# EAGLE schematic MOSFET_Driver_8_24_2505D (EAGLE 6.1)
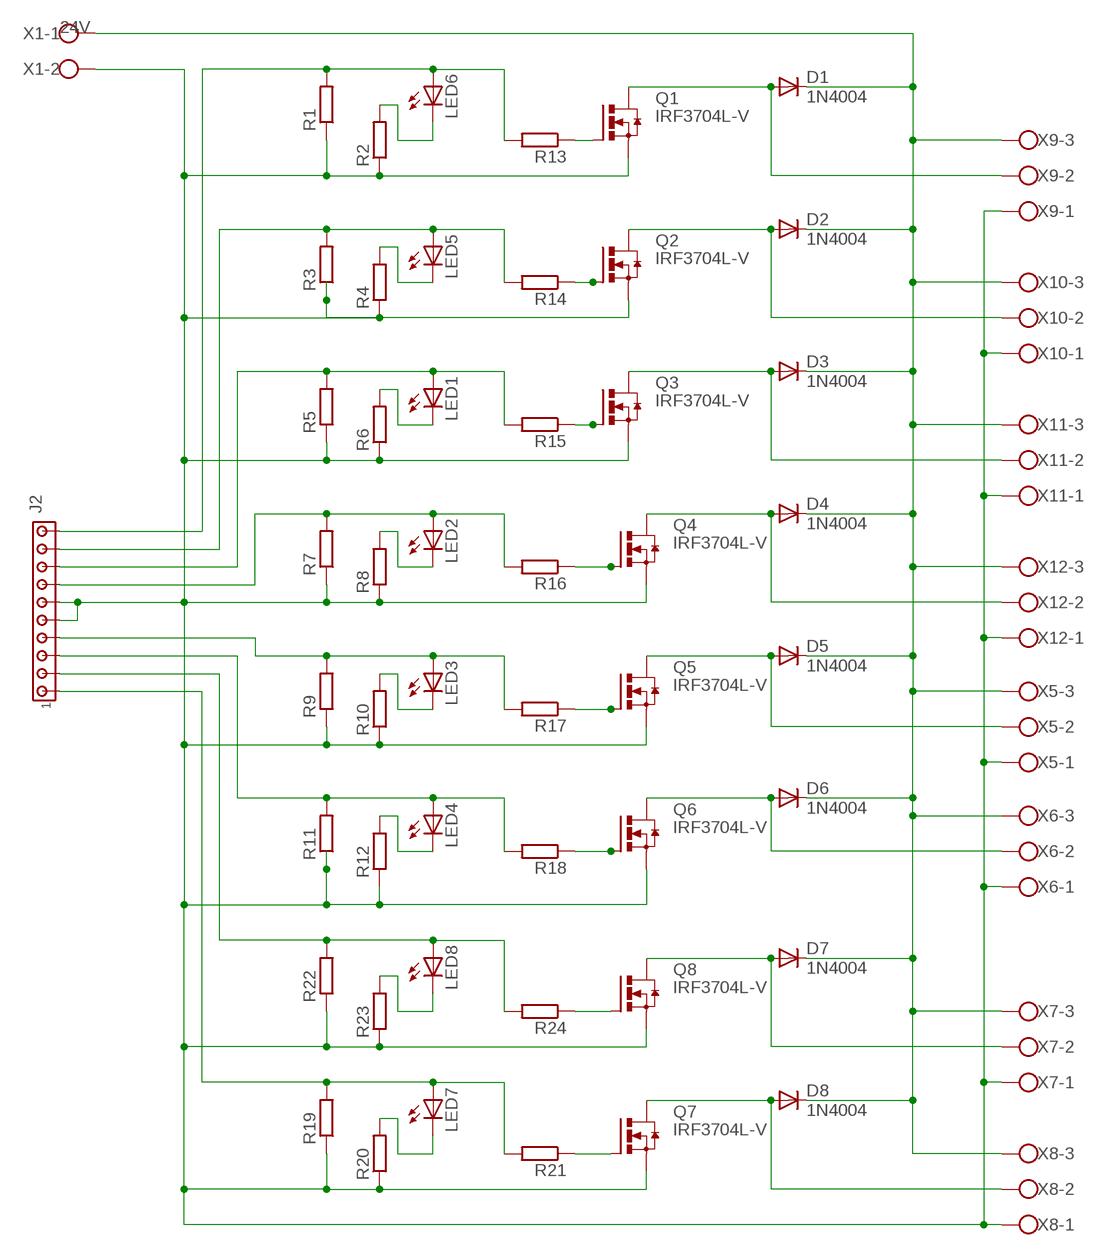
[diagram p0: schematic, sheet 1]

## Parts
D1  1N4004  [DO41-10]
D2  1N4004  [DO41-10]
D3  1N4004  [DO41-10]
D4  1N4004  [DO41-10]
D5  1N4004  [DO41-10]
D6  1N4004  [DO41-10]
D7  1N4004  [DO41-10]
D8  1N4004  [DO41-10]
J2  MTA10-156  [1X10MTA]
LED1  LED5MM  [LED5MM]
LED2  LED5MM  [LED5MM]
LED3  LED5MM  [LED5MM]
LED4  LED5MM  [LED5MM]
LED5  LED5MM  [LED5MM]
LED6  LED5MM  [LED5MM]
LED7  LED5MM  [LED5MM]
LED8  LED5MM  [LED5MM]
Q1  IRF3704L-V  [TO262-V]
Q2  IRF3704L-V  [TO262-V]
Q3  IRF3704L-V  [TO262-V]
Q4  IRF3704L-V  [TO262-V]
Q5  IRF3704L-V  [TO262-V]
Q6  IRF3704L-V  [TO262-V]
Q7  IRF3704L-V  [TO262-V]
Q8  IRF3704L-V  [TO262-V]
R1  R-EU_0207/10  [0207/10]
R2  R-EU_0207/10  [0207/10]
R3  R-EU_0207/10  [0207/10]
R4  R-EU_0207/10  [0207/10]
R5  R-EU_0207/10  [0207/10]
R6  R-EU_0207/10  [0207/10]
R7  R-EU_0207/10  [0207/10]
R8  R-EU_0207/10  [0207/10]
R9  R-EU_0207/10  [0207/10]
R10  R-EU_0207/10  [0207/10]
R11  R-EU_0207/10  [0207/10]
R12  R-EU_0207/10  [0207/10]
R13  R-EU_0207/10  [0207/10]
R14  R-EU_0207/10  [0207/10]
R15  R-EU_0207/10  [0207/10]
R16  R-EU_0207/10  [0207/10]
R17  R-EU_0207/10  [0207/10]
R18  R-EU_0207/10  [0207/10]
R19  R-EU_0207/10  [0207/10]
R20  R-EU_0207/10  [0207/10]
R21  R-EU_0207/10  [0207/10]
R22  R-EU_0207/10  [0207/10]
R23  R-EU_0207/10  [0207/10]
R24  R-EU_0207/10  [0207/10]
X1  W237-102  [W237-102]
X5  W237-103  [W237-103]
X6  W237-103  [W237-103]
X7  W237-103  [W237-103]
X8  W237-103  [W237-103]
X9  W237-103  [W237-103]
X10  W237-103  [W237-103]
X11  W237-103  [W237-103]
X12  W237-103  [W237-103]

## Nets
N$1: J2.10 LED6.A R1.2 R13.2
N$2: LED6.K(C) R2.2
N$3: D1.A Q1.2(D) X9.2
N$4: J2.1 LED7.A R19.2 R21.2
N$5: LED7.K(C) R20.2
N$6: D3.A Q3.2(D) X11.2
N$7: D2.A Q2.2(D) X10.2
N$8: D4.A Q4.2(D) X12.2
N$9: D5.A Q5.2(D) X5.2
N$10: D6.A Q6.2(D) X6.2
N$11: J2.9 LED5.A R3.2 R14.2
N$12: J2.8 LED1.A R5.2 R15.2
N$13: J2.7 LED2.A R7.2 R16.2
N$14: J2.4 LED3.A R9.2 R17.2
N$15: J2.3 LED4.A R11.2 R18.2
N$16: Q1.1(G) R13.1
N$17: Q2.1(G) R14.1
N$18: Q3.1(G) R15.1
N$19: LED5.K(C) R4.2
N$20: LED1.K(C) R6.2
N$21: LED2.K(C) R8.2
N$22: LED3.K(C) R10.2
N$23: LED4.K(C) R12.2
N$24: Q4.1(G) R16.1
N$25: D1.C D2.C D3.C D4.C D5.C D6.C D7.C D8.C X1.1 X5.3 X6.3 X7.3 X8.3 X9.3 X10.3 X11.3 X12.3
N$26: Q5.1(G) R17.1
N$27: Q6.1(G) R18.1
N$28: J2.5 J2.6 Q1.3(S) Q2.3(S) Q3.3(S) Q4.3(S) Q5.3(S) Q6.3(S) Q7.3(S) Q8.3(S) R1.1 R2.1 R3.1 R4.1 R5.1 R6.1 R7.1 R8.1 R9.1 R10.1 R11.1 R12.1 R19.1 R20.1 R22.1 R23.1 X1.2 X5.1 X6.1 X7.1 X8.1 X9.1 X10.1 X11.1 X12.1
N$29: D8.A Q7.2(D) X8.2
N$31: Q7.1(G) R21.1
N$33: J2.2 LED8.A R22.2 R24.2
N$34: LED8.K(C) R23.2
N$35: D7.A Q8.2(D) X7.2
N$37: Q8.1(G) R24.1

## Library data of the parts
D1-D8 = diode:1N4004: DIODE general purpose rectifier, 1 A
J2 = con-amp:MTA10-156: AMP connector
LED1-LED8 = led:LED: LED OSRAM: - CHIPLED LG R971, LG N971, LY N971, LG Q971, LY Q971, LO R971, LY R971 LH N974, LH R974 LS Q976, LO Q976, LY Q976 LO Q996 - Hyper CHIPLED LW Q18S LB Q993, LB Q99A, LB R99A - SideLED LS A670, LO A670, LY A670, LG A670, LP A670 LB A673, LV A673, LT A673, LW A673 LH A674 LY A675 LS A676, LA A676, LO A676, LY A676, LW A676 LS A679, LY A679, LG A679 - Hyper Micro SIDELED® LS Y876, LA Y876, LO Y876, LY Y876 LT Y87S - SmartLED LW L88C, LW L88S LB L89C, LB L89S, LG L890 LS L89K, LO L89K, LY L89K LS L896, LA L896, LO L896, LY L896 - TOPLED LS T670, LO T670, LY T670, LG T670, LP T670 LSG T670, LSP T670, LSY T670, LOP T670, LYG T670 LG T671, LOG T671, LSG T671 LB T673, LV T673, LT T673, LW T673 LH T674 LS T676, LA T676, LO T676, LY T676, LB T676, LH T676, LSB T676, LW T676 LB T67C, LV T67C, LT T67C, LS T67K, LO T67K, LY T67K, LW E67C LS E67B, LA E67B, LO E67B, LY E67B, LB E67C, LV E67C, LT E67C LW T67C LS T679, LY T679, LG T679 LS T770, LO T770, LY T770, LG T770, LP T770 LB T773, LV T773, LT T773, LW T773 LH T774 LS E675, LA E675, LY E675, LS T675 LS T776, LA T776, LO T776, LY T776, LB T776 LHGB T686 LT T68C, LB T68C - Hyper Mini TOPLED® LB M676 - Mini TOPLED Santana® LG M470 LS M47K, LO M47K, LY M47K Source: http://www.osram.convergy.de LUXEON: - LUMILED® LXK2-PW12-R00, LXK2-PW12-S00, LXK2-PW14-U00, LXK2-PW14-V00 LXK2-PM12-R00, LXK2-PM12-S00, LXK2-PM14-U00 LXK2-PE12-Q00, LXK2-PE12-R00, LXK2-PE12-S00, LXK2-PE14-T00, LXK2-PE14-U00 LXK2-PB12-K00, LXK2-PB12-L00, LXK2-PB12-M00, LXK2-PB14-N00, LXK2-PB14-P00, LXK2-PB14-Q00 LXK2-PR12-L00, LXK2-PR12-M00, LXK2-PR14-Q00, LXK2-PR14-R00 LXK2-PD12-Q00, LXK2-PD12-R00, LXK2-PD12-S00 LXK2-PH12-R00, LXK2-PH12-S00 LXK2-PL12-P00, LXK2-PL12-Q00, LXK2-PL12-R00 Source: www.luxeon.com KINGBRIGHT: KA-3528ASYC Source: www.kingbright.com
Q1-Q8 = transistor-power:IRF3704: SMPS MOSFET HEXFET® Power MOSFET Source: http://www.irf.com/product-info/datasheets/data/irf3704.pdf
R1-R24 = resistor:R-EU_: RESISTOR, European symbol
X1 = con-wago-500:W237-102: WAGO SCREW CLAMP
X5-X12 = con-wago-500:W237-103: WAGO SCREW CLAMP